# EasyEDA Pro project SSRC v1.eprj, board PCB3
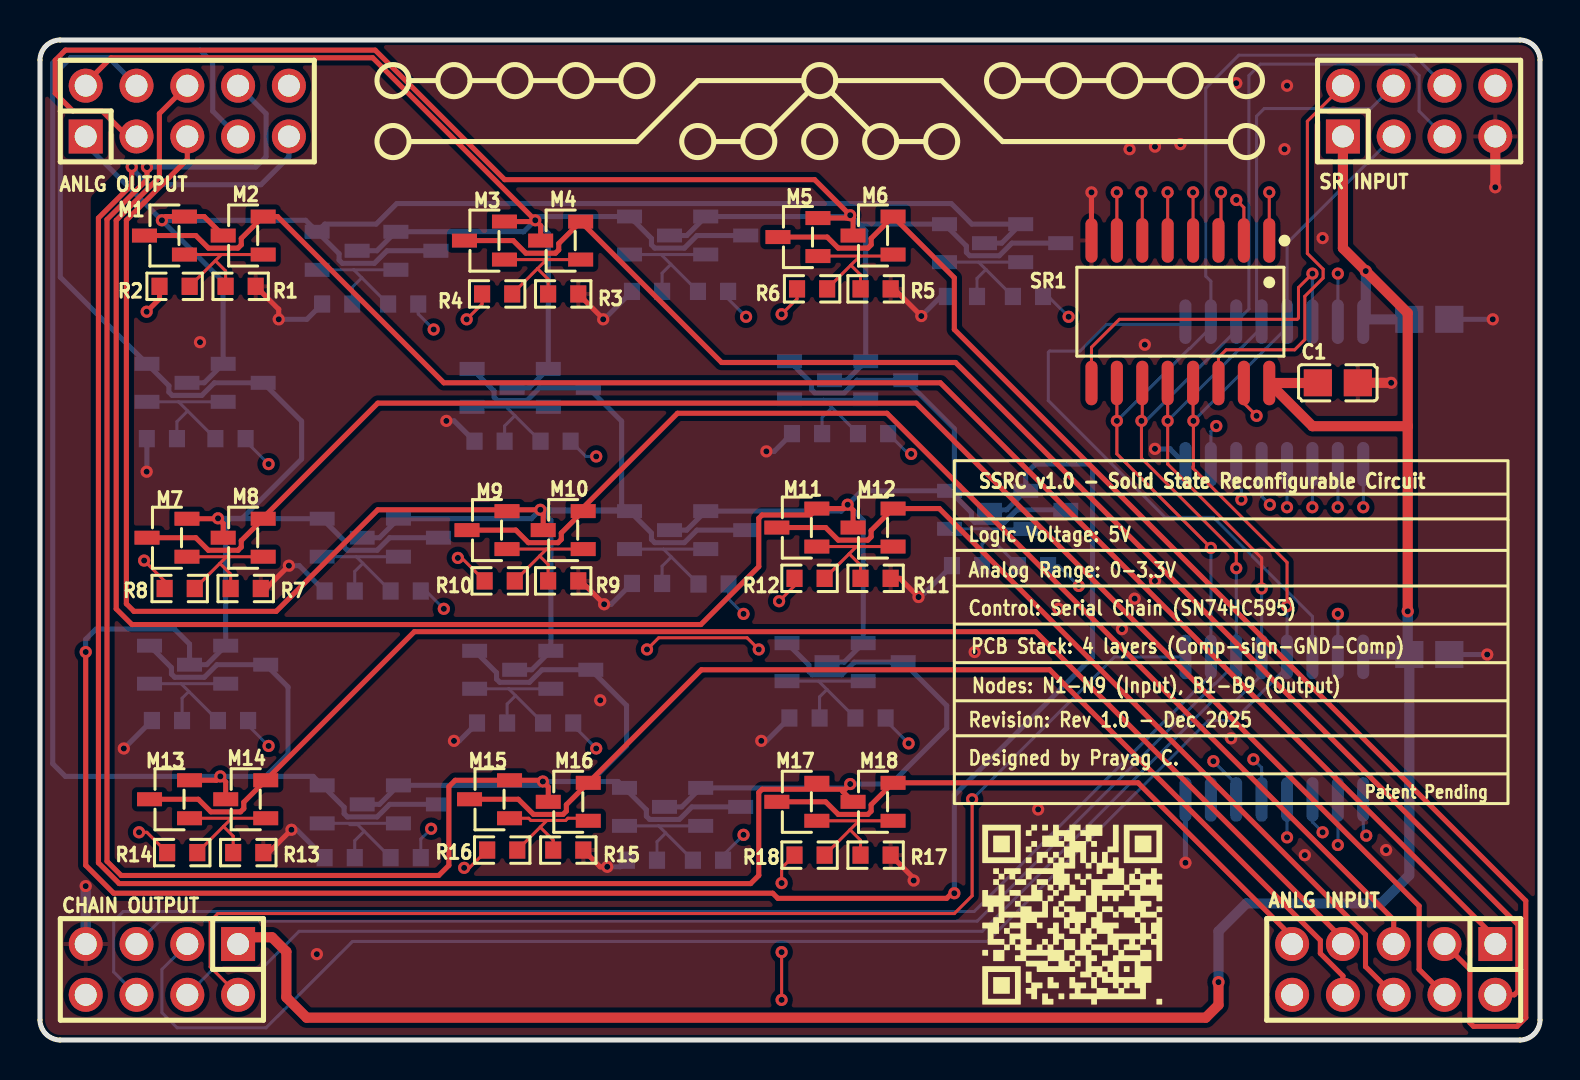
[diagram p2: board, top side]
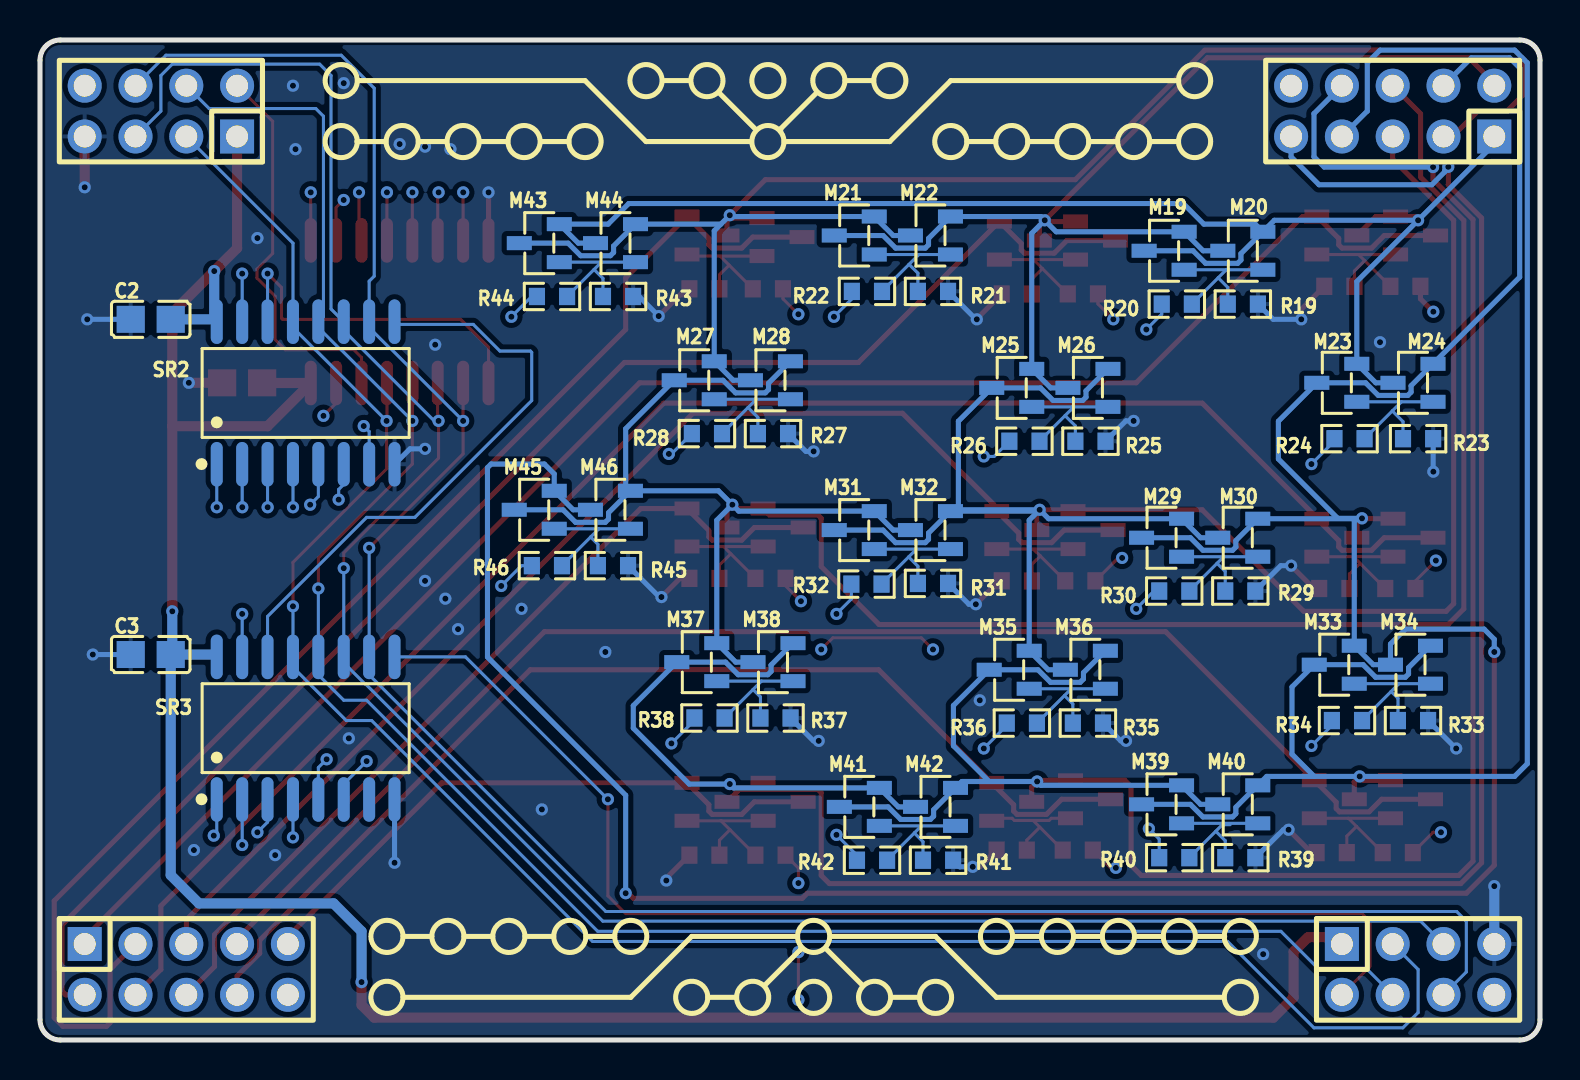
[diagram p3: board, bottom side, seen from below]

Outline 75.01 x 50.01 mm; copper layers: Top Layer, Inner1, Inner2, Inner3, Inner4, Inner5, Inner6, Inner7, Inner8, Inner9, Inner10, Inner11, Inner12, Inner13, Inner14, Inner15, Inner16, Inner17, Inner18, Inner19, Inner20, Inner21, Inner22, Inner23, Inner24, Inner25, Inner26, Inner27, Inner28, Inner29, Inner30, Bottom Layer. Coordinates in mm from the lower left corner of the outline.
Outline path: 0,49 0,1.02 arc(0.3,0.3) 1.02,0 73.99,0 arc(74.71,0.3) 75.01,1.02 75.01,49 arc(74.71,49.71) 73.99,50.01 1.02,50.01 arc(0.3,49.71) 0,49
Stack: Top Layer 0.035mm Outer layer thickness 1oz / Dielectric1 0.2104mm 7628 RC49% 8.6mil / Inner1 0.0152mm Inner layer thickness / Dielectric2 1.065mm 1.1mm H/HOZ Copper / Inner2 0.0152mm Inner layer thickness / Dielectric3 0.2104mm 7628 RC49% 8.6mil / Bottom Layer 0.035mm Outer layer thickness 1oz

## Design rules (mm)
template: JLCPCB Capability(Two Layers Board)
spacing copperThickness1oz (default): track to track 0.102, other pairs 0.152 to 0.3
spacing copperThickness2oz: track to track 0.203, other pairs 0.152 to 0.3
track width copperThickness1oz (default): min 0.127, default 0.254, max 2.54
track width copperThickness2oz: min 0.203, default 0.254, max 2.54
differential pair differentialPair (default): width min 0.127, default 0.254, max 2.54; gap min 0.152, default 0.152
via viaSize (default): diameter min 0.5, default 0.61, max 10; hole min 0.3, default 0.305, max 6.3

## Placement (name value [footprint] x y rotation side)
ANLG INPUT  PZ254V-12-10P  [HDR-TH_10P-P2.54-V-M-R2-C5-S2.54]  67.69 3.53 180 top
ANLG OUTPUT  PZ254V-12-10P  [HDR-TH_10P-P2.54-V-M-R2-C5-S2.54]  7.37 46.46 0 top
C1  100nF  [C0805]  64.9 32.87 0 top
C2  100nF  [C0805]  69.47 36.04 0 bottom
C3  100nF  [C0805]  69.47 19.28 0 bottom
CHAIN OUTPUT  PZ254V-12-8P  [HDR-TH_8P-P2.54-V-M-R2-C4-S2.54]  6.1 3.53 180 top
M1  -  [SOT-23-3_L2.9-W1.3-P1.90-LS2.4-BR]  6.22 40.23 0 top
M2  -  [SOT-23-3_L2.9-W1.3-P1.90-LS2.4-BR]  10.16 40.23 0 top
M3  -  [SOT-23-3_L2.9-W1.3-P1.90-LS2.4-BR]  22.23 39.98 0 top
M4  -  [SOT-23-3_L2.9-W1.3-P1.90-LS2.4-BR]  26.04 39.98 0 top
M5  -  [SOT-23-3_L2.9-W1.3-P1.90-LS2.4-BR]  37.9 40.16 0 top
M6  -  [SOT-23-3_L2.9-W1.3-P1.90-LS2.4-BR]  41.66 40.23 0 top
M7  -  [SOT-23-3_L2.9-W1.3-P1.90-LS2.4-BR]  6.35 25.12 0 top
M8  -  [SOT-23-3_L2.9-W1.3-P1.90-LS2.4-BR]  10.16 25.12 0 top
M9  -  [SOT-23-3_L2.9-W1.3-P1.90-LS2.4-BR]  22.35 25.5 0 top
M10  -  [SOT-23-3_L2.9-W1.3-P1.90-LS2.4-BR]  26.16 25.5 0 top
M11  -  [SOT-23-3_L2.9-W1.3-P1.90-LS2.4-BR]  37.85 25.63 0 top
M12  -  [SOT-23-3_L2.9-W1.3-P1.90-LS2.4-BR]  41.66 25.63 0 top
M13  -  [SOT-23-3_L2.9-W1.3-P1.90-LS2.4-BR]  6.48 12.04 0 top
M14  -  [SOT-23-3_L2.9-W1.3-P1.90-LS2.4-BR]  10.29 12.04 0 top
M15  -  [SOT-23-3_L2.9-W1.3-P1.90-LS2.4-BR]  22.48 12.04 0 top
M16  -  [SOT-23-3_L2.9-W1.3-P1.90-LS2.4-BR]  26.42 11.91 0 top
M17  -  [SOT-23-3_L2.9-W1.3-P1.90-LS2.4-BR]  37.85 11.91 0 top
M18  -  [SOT-23-3_L2.9-W1.3-P1.90-LS2.4-BR]  41.66 11.91 0 top
M19  -  [SOT-23-3_L2.9-W1.3-P1.90-LS2.4-BR]  18.8 39.47 180 bottom
M20  -  [SOT-23-3_L2.9-W1.3-P1.90-LS2.4-BR]  14.86 39.47 180 bottom
M21  -  [SOT-23-3_L2.9-W1.3-P1.90-LS2.4-BR]  34.29 40.23 180 bottom
M22  -  [SOT-23-3_L2.9-W1.3-P1.90-LS2.4-BR]  30.48 40.23 180 bottom
M23  -  [SOT-23-3_L2.9-W1.3-P1.90-LS2.4-BR]  10.16 32.87 180 bottom
M24  -  [SOT-23-3_L2.9-W1.3-P1.90-LS2.4-BR]  6.35 32.87 180 bottom
M25  -  [SOT-23-3_L2.9-W1.3-P1.90-LS2.4-BR]  26.42 32.61 180 bottom
M26  -  [SOT-23-3_L2.9-W1.3-P1.90-LS2.4-BR]  22.61 32.61 180 bottom
M27  -  [SOT-23-3_L2.9-W1.3-P1.90-LS2.4-BR]  42.29 32.99 180 bottom
M28  -  [SOT-23-3_L2.9-W1.3-P1.90-LS2.4-BR]  38.48 32.99 180 bottom
M29  -  [SOT-23-3_L2.9-W1.3-P1.90-LS2.4-BR]  18.92 25.12 180 bottom
M30  -  [SOT-23-3_L2.9-W1.3-P1.90-LS2.4-BR]  15.11 25.12 180 bottom
M31  -  [SOT-23-3_L2.9-W1.3-P1.90-LS2.4-BR]  34.29 25.5 180 bottom
M32  -  [SOT-23-3_L2.9-W1.3-P1.90-LS2.4-BR]  30.48 25.5 180 bottom
M33  -  [SOT-23-3_L2.9-W1.3-P1.90-LS2.4-BR]  10.29 18.77 180 bottom
M34  -  [SOT-23-3_L2.9-W1.3-P1.90-LS2.4-BR]  6.48 18.77 180 bottom
M35  -  [SOT-23-3_L2.9-W1.3-P1.90-LS2.4-BR]  26.54 18.52 180 bottom
M36  -  [SOT-23-3_L2.9-W1.3-P1.90-LS2.4-BR]  22.73 18.52 180 bottom
M37  -  [SOT-23-3_L2.9-W1.3-P1.90-LS2.4-BR]  42.16 18.9 180 bottom
M38  -  [SOT-23-3_L2.9-W1.3-P1.90-LS2.4-BR]  38.35 18.9 180 bottom
M39  -  [SOT-23-3_L2.9-W1.3-P1.90-LS2.4-BR]  18.92 11.79 180 bottom
M40  -  [SOT-23-3_L2.9-W1.3-P1.90-LS2.4-BR]  15.11 11.79 180 bottom
M41  -  [SOT-23-3_L2.9-W1.3-P1.90-LS2.4-BR]  34.04 11.66 180 bottom
M42  -  [SOT-23-3_L2.9-W1.3-P1.90-LS2.4-BR]  30.23 11.66 180 bottom
M43  -  [SOT-23-3_L2.9-W1.3-P1.90-LS2.4-BR]  50.04 39.85 180 bottom
M44  -  [SOT-23-3_L2.9-W1.3-P1.90-LS2.4-BR]  46.23 39.85 180 bottom
M45  -  [SOT-23-3_L2.9-W1.3-P1.90-LS2.4-BR]  50.29 26.52 180 bottom
M46  -  [SOT-23-3_L2.9-W1.3-P1.90-LS2.4-BR]  46.48 26.52 180 bottom
R1  -  [RC1206FR-07220KL]  10.03 37.69 0 top
R2  -  [RC1206FR-1022RL]  6.73 37.69 0 top
R3  -  [RC1206FR-07220KL]  26.16 37.31 0 top
R4  -  [RC1206FR-1022RL]  22.86 37.31 0 top
R5  -  [RC1206FR-07220KL]  41.78 37.57 0 top
R6  -  [RC1206FR-1022RL]  38.61 37.57 0 top
R7  -  [RC1206FR-07220KL]  10.29 22.58 0 top
R8  -  [RC1206FR-1022RL]  6.98 22.58 0 top
R9  -  [RC1206FR-07220KL]  26.16 22.96 0 top
R10  -  [RC1206FR-1022RL]  22.99 22.96 0 top
R11  -  [RC1206FR-07220KL]  41.78 23.09 0 top
R12  -  [RC1206FR-1022RL]  38.48 23.09 0 top
R13  -  [RC1206FR-07220KL]  10.41 9.37 0 top
R14  -  [RC1206FR-1022RL]  7.11 9.37 0 top
R15  -  [RC1206FR-07220KL]  26.42 9.5 0 top
R16  -  [RC1206FR-1022RL]  23.11 9.5 0 top
R17  -  [RC1206FR-07220KL]  41.78 9.25 0 top
R18  -  [RC1206FR-1022RL]  38.48 9.25 0 top
R19  -  [RC1206FR-07220KL]  14.86 36.8 180 bottom
R20  -  [RC1206FR-1022RL]  18.16 36.8 180 bottom
R21  -  [RC1206FR-07220KL]  30.35 37.44 180 bottom
R22  -  [RC1206FR-1022RL]  33.66 37.44 180 bottom
R23  -  [RC1206FR-07220KL]  6.1 30.07 180 bottom
R24  -  [RC1206FR-1022RL]  9.53 30.07 180 bottom
R25  -  [RC1206FR-07220KL]  22.48 29.95 180 bottom
R26  -  [RC1206FR-1022RL]  25.78 29.95 180 bottom
R27  -  [RC1206FR-07220KL]  38.35 30.33 180 bottom
R28  -  [RC1206FR-1022RL]  41.66 30.33 180 bottom
R29  -  [RC1206FR-07220KL]  14.99 22.45 180 bottom
R30  -  [RC1206FR-1022RL]  18.29 22.45 180 bottom
R31  -  [RC1206FR-07220KL]  30.35 22.83 180 bottom
R32  -  [RC1206FR-1022RL]  33.68 22.8 180 bottom
R33  -  [RC1206FR-07220KL]  6.35 15.98 180 bottom
R34  -  [RC1206FR-1022RL]  9.65 15.98 180 bottom
R35  -  [RC1206FR-07220KL]  22.61 15.85 180 bottom
R36  -  [RC1206FR-1022RL]  25.91 15.85 180 bottom
R37  -  [RC1206FR-07220KL]  38.23 16.1 180 bottom
R38  -  [RC1206FR-1022RL]  41.53 16.1 180 bottom
R39  -  [RC1206FR-07220KL]  14.99 9.12 180 bottom
R40  -  [RC1206FR-1022RL]  18.29 9.12 180 bottom
R41  -  [RC1206FR-07220KL]  30.1 8.99 180 bottom
R42  -  [RC1206FR-1022RL]  33.4 8.99 180 bottom
R43  -  [RC1206FR-07220KL]  46.1 37.19 180 bottom
R44  -  [RC1206FR-1022RL]  49.4 37.19 180 bottom
R45  -  [RC1206FR-07220KL]  46.36 23.72 180 bottom
R46  -  [RC1206FR-1022RL]  49.66 23.72 180 bottom
SR1  SN74HC595NSR  [SOP-16_L10.3-W5.4-P1.27-LS7.8-BL]  57.02 36.42 180 top
SR2  SN74HC595NSR  [SOP-16_L10.3-W5.4-P1.27-LS7.8-BL]  61.72 32.36 180 bottom
SR3  SN74HC595NSR  [SOP-16_L10.3-W5.4-P1.27-LS7.8-BL]  61.72 15.6 180 bottom
SR INPUT  PZ254V-12-8P  [HDR-TH_8P-P2.54-V-M-R2-C4-S2.54]  68.96 46.46 0 top

## Footprints (pads in the part's own frame, mm; a bottom-side part is the same pattern mirrored in y, then rotated)
C0805
  rect 1.41x1.35 smd: 1(-1,0) 2(1,0)
HDR-TH_8P-P2.54-V-M-R2-C4-S2.54
  rect 1.7x1.7 hole 1.1: 1(-3.81,-1.27)
  round 1.7 hole 1.1: 2(-3.81,1.27) 3(-1.27,-1.27) 4(-1.27,1.27) 5(1.27,-1.27) 6(1.27,1.27) 7(3.81,-1.27) 8(3.81,1.27)
HDR-TH_10P-P2.54-V-M-R2-C5-S2.54
  rect 1.7x1.7 hole 1.1: 1(-5.08,-1.27)
  round 1.7 hole 1.1: 2(-5.08,1.27) 3(-2.54,-1.27) 4(-2.54,1.27) 5(0,-1.27) 6(0,1.27) 7(2.54,-1.27) 8(2.54,1.27) 9(5.08,-1.27) 10(5.08,1.27)
RC1206FR-1022RL
  rect 0.806x0.864 smd: 1(-0.753,0) 2(0.753,0)
RC1206FR-07220KL
  rect 0.806x0.864 smd: 1(-0.753,0) 2(0.753,0)
SOP-16_L10.3-W5.4-P1.27-LS7.8-BL
  oval 0.602x2.231 smd: 1(-4.445,-3.566) 2(-3.175,-3.566) 3(-1.905,-3.566) 4(-0.635,-3.566) 5(0.635,-3.566) 6(1.905,-3.566) 7(3.175,-3.566) 8(4.445,-3.566) 9(4.445,3.566) 10(3.175,3.566) 11(1.905,3.566) 12(0.635,3.566) 13(-0.635,3.566) 14(-1.905,3.566) 15(-3.175,3.566) 16(-4.445,3.566)
SOT-23-3_L2.9-W1.3-P1.90-LS2.4-BR
  rect 1.25x0.7 smd: 1(1,-0.95) 2(1,0.95) 3(-1,0)

## Nets
+5V: C1.1 C2.1 C3.1 CHAIN OUTPUT.1 SR1.16 SR2.16 SR3.16 SR INPUT.1
GND: C1.2 C2.2 C3.2 CHAIN OUTPUT.7 R1.2 R3.2 R5.2 R7.2 R9.2 R11.2 R13.2 R15.2 R17.2 R19.2 R21.2 R23.2 R25.2 R27.2 R29.2 R31.2 R33.2 R35.2 R37.2 R39.2 R41.2 R43.2 R45.2 SR1.8 SR2.8 SR3.8 SR INPUT.7
B1: ANLG OUTPUT.1 M1.2 M2.3 M19.3 M20.2 M23.2 M24.3 M43.2 M44.3
B2: ANLG OUTPUT.2 M3.2 M4.3 M19.2 M20.3 M21.3 M22.2 M25.2 M26.3
B3: ANLG OUTPUT.3 M5.2 M6.3 M21.2 M22.3 M27.2 M28.3 M43.3 M44.2
B4: ANLG OUTPUT.4 M7.2 M8.3 M23.3 M24.2 M29.3 M30.2 M33.2 M34.3 M45.2 M46.3
B5: ANLG OUTPUT.5 M9.2 M10.3 M25.3 M26.2 M29.2 M30.3 M31.3 M32.2 M35.2 M36.3
B6: ANLG OUTPUT.6 M11.2 M12.3 M27.3 M28.2 M31.2 M32.3 M37.2 M38.3 M45.3 M46.2
B7: ANLG OUTPUT.7 M13.2 M14.3 M33.3 M34.2 M39.3 M40.2
B8: ANLG OUTPUT.8 M15.2 M16.3 M35.3 M36.2 M39.2 M40.3 M41.3 M42.2
B9: ANLG OUTPUT.9 M17.2 M18.3 M37.3 M38.2 M41.2 M42.3
G1: R2.1 SR1.15
G3: R4.1 SR1.1
G5: R6.1 SR1.2
G7: R8.1 SR1.3
G9: R10.1 SR1.4
G11: R12.1 SR1.5
G13: R14.1 SR1.6
G15: R16.1 SR1.7
G17: R18.1 SR2.15
G19: R20.1 SR2.1
G21: R22.1 SR2.2
G23: R24.1 SR2.3
G25: R26.1 SR2.4
G27: R28.1 SR2.5
G29: R30.1 SR2.6
G31: R32.1 SR2.7
G33: R34.1 SR3.15
G35: R36.1 SR3.1
G37: R38.1 SR3.2
G39: R40.1 SR3.3
G41: R42.1 SR3.4
G43: R44.1 SR3.5
G45: R46.1 SR3.6
LCLK: CHAIN OUTPUT.4 SR1.12 SR2.12 SR3.12 SR INPUT.4
MR: CHAIN OUTPUT.6 SR1.10 SR2.10 SR3.10 SR INPUT.6
N1: ANLG INPUT.1 M1.3 M2.2
N2: ANLG INPUT.2 M3.3 M4.2
N3: ANLG INPUT.3 M5.3 M6.2
N4: ANLG INPUT.4 M7.3 M8.2
N5: ANLG INPUT.5 M9.3 M10.2
N6: ANLG INPUT.6 M11.3 M12.2
N7: ANLG INPUT.7 M13.3 M14.2
N8: ANLG INPUT.8 M15.3 M16.2
N9: ANLG INPUT.9 M17.3 M18.2
OE: CHAIN OUTPUT.3 SR1.13 SR2.13 SR3.13 SR INPUT.3
SCLK: CHAIN OUTPUT.5 SR1.11 SR2.11 SR3.11 SR INPUT.5
$1N322: M25.1 M26.1 R25.1 R26.2
$1N1509: M41.1 M42.1 R41.1 R42.2
$1N1583: M39.1 M40.1 R39.1 R40.2
$1N1657: M33.1 M34.1 R33.1 R34.2
$1N1731: M23.1 M24.1 R23.1 R24.2
$1N4820: M1.1 M2.1 R1.1 R2.2
$1N4826: M3.1 M4.1 R3.1 R4.2
$1N4832: M5.1 M6.1 R5.1 R6.2
$1N4838: M7.1 M8.1 R7.1 R8.2
$1N4844: M9.1 M10.1 R9.1 R10.2
$1N4850: M11.1 M12.1 R11.1 R12.2
$1N4856: M13.1 M14.1 R13.1 R14.2
$1N4862: M15.1 M16.1 R15.1 R16.2
$1N4868: M17.1 M18.1 R17.1 R18.2
$1N10938: M27.1 M28.1 R27.1 R28.2
$1N10996: M19.1 M20.1 R19.1 R20.2
$1N11052: M21.1 M22.1 R21.1 R22.2
$1N11108: M29.1 M30.1 R29.1 R30.2
$1N11164: M31.1 M32.1 R31.1 R32.2
$1N11220: M35.1 M36.1 R35.1 R36.2
$1N11276: M37.1 M38.1 R37.1 R38.2
$1N19303: M43.1 M44.1 R43.1 R44.2
$1N19419: M45.1 M46.1 R45.1 R46.2
$1N32987: SR1.9 SR2.14
$1N32993: SR2.9 SR3.14
$1N34192: SR1.14 SR INPUT.2
$1N34221: CHAIN OUTPUT.2 SR3.9

Pads without a net: ANLG INPUT 10; ANLG OUTPUT 10; CHAIN OUTPUT 8; SR3 7; SR INPUT 8

## Via types
v1: diameter 0.61, hole 0.305, Top Layer to Bottom Layer, 119 vias

## Routing (per net, layer and track width the routed paths; a pad name or vN(x,y) marks a point on that pad's centre or on a via; arc(x,y) is an arc through that point)
+5V: length 122.5
  Top Layer w0.508: 68.39,30.7 68.39,36.36 v1(66.29,38.46) 65.15,39.6 SR INPUT.1 ; 68.39,30.7 63.63,30.7 SR1.16 63.89,32.86 C1.1 ; 68.39,30.7 v1(68.39,21.44) ; CHAIN OUTPUT.1 10.24,5.14 11.6,5.14 12.32,4.42 12.32,2.13 13.34,1.12 58.29,1.12 58.93,1.75 v1(58.93,2.9)
  Bottom Layer w0.508: v1(66.29,38.46) 66.29,36.05 66.28,36.04 ; v1(68.39,21.44) 68.39,19.36 C3.1 ; C3.1 66.28,19.28 SR3.16 ; C3.1 68.47,8.25 67.06,6.83 60.33,6.83 58.93,5.44 v1(58.93,2.9) ; 66.28,36.04 SR2.16 ; 66.28,36.04 C2.1
GND: length 61.7
  Top Layer w0.254: v1(12.45,23.72) 11.3,22.58 R7.2 ; R11.2 43,23.09 v1(43.93,22.15) ; v1(43.69,7.98) 43.69,8.09 R17.2 ; v1(28.16,36.04) 28.16,36.07 R3.2 ; SR1.8 v1(52.58,42.39) ; R5.2 42.71,37.57 v1(44.07,36.21) ; v1(28.21,21.79) 27.04,22.96 R9.2 ; v1(28.36,8.66) 28.01,8.66 R15.2 ; R13.2 11.43,9.37 v1(12.57,10.52) ; v1(11.94,36.04) 11.94,36.54 R1.2
  Top Layer w0.508: v1(67.56,32.87) C1.2 ; SR INPUT.7 v1(72.77,42.65)
  Bottom Layer w0.254: R33.2 4.2,14.58 v1(4.19,14.58) ; R41.2 29.02,8.66 v1(28.36,8.66) ; R43.2 45.05,37.19 v1(44.07,36.21) ; R31.2 28.56,21.79 v1(28.21,21.79) ; R39.2 12.84,10.52 v1(12.57,10.52) ; R35.2 20.96,14.96 v1(20.7,14.96) ; R27.2 36.71,29.44 v1(36.32,29.44) ; v1(28.16,36.04) 28.2,36.04 R21.2 ; v1(12.45,23.72) 12.96,23.72 R29.2 ; v1(5.33,28.42) 5.34,28.43 R23.2 ; v1(20.32,30.96) 20.71,30.96 R25.2 ; C2.2 v1(72.64,36.04) ; R45.2 44.03,22.15 v1(43.93,22.15) ; v1(11.94,36.04) 13.34,36.04 R19.2 ; v1(55.75,29.57) 56.51,29.57 SR2.8 ; v1(36.07,14.96) 36.33,14.96 R37.2 ; C3.2 v1(72.37,19.28) ; SR3.8 v1(57.28,8.86)
  Bottom Layer w0.508: CHAIN OUTPUT.7 v1(2.29,7.7)
  vias: v1(8,34.9) v1(13.84,4.29) v1(28.01,16.99) v1(46.74,19.41) v1(49.91,11.53) v1(50.93,21.56) v1(54.1,20.55) v1(54.48,44.55) v1(54.74,22.07) v1(55.25,34.77) v1(55.75,44.68) v1(55.75,22.96) v1(57.02,44.81) v1(59.56,15.09) v1(59.82,47.85) v1(62.23,44.55) v1(62.36,47.73) v1(63.25,9.25) v1(64.14,40.11) v1(67.31,9.5)
B1: length 73.4
  Top Layer w0.254: M2.3 8.21,41.18 6.28,41.18 v1(6.1,41)
  Bottom Layer w0.254: M19.3 17.35,39.47 16.72,38.84 15.12,38.84 14.95,39.01 14.95,39.33 M20.2 ; M24.3 8.21,32.87 M23.2 9.16,37.93 v1(6.1,41) ; M20.2 14.24,40.8 16.81,40.8 17.84,41.83 45.57,41.83 46.6,40.8 M43.2 48.09,39.85 M44.3 ; M20.2 13.29,41 v1(6.1,41) ; v1(6.1,41) 2.29,44.81 ANLG OUTPUT.1
B2: length 60.3
  Top Layer w0.254: M4.3 25.04,40.73 v1(24.77,41) ; v1(24.77,41) 24.7,40.93 M3.2 ; v1(24.77,41) 16.64,49.12 3.56,49.12 2.29,47.85 ANLG OUTPUT.2
  Bottom Layer w0.254: v1(24.77,41) 24.19,40.42 M19.2 16.85,39.47 M20.3 ; v1(24.77,41) 24.95,41.18 29.48,41.18 30.58,40.09 30.58,39.77 30.74,39.6 32.22,39.6 32.85,40.23 M21.3 ; v1(24.77,41) 25.42,40.34 M25.2 24.47,32.61 M26.3
B3: length 83.2
  Top Layer w0.254: v1(40.51,41.25) 40.66,41.11 M6.3 ; v1(40.51,41.25) 40.37,41.11 M5.2 ; v1(40.51,41.25) 38.73,43.03 23.24,43.03 16.76,49.5 1.27,49.5 0.76,49 0.76,47.35 1.65,46.46 3.11,46.46 4.38,45.19 ANLG OUTPUT.3
  Bottom Layer w0.254: M28.3 40.34,32.99 M27.2 41.29,40.47 40.96,40.8 ; 40.96,40.8 M44.2 46.32,39.71 46.32,39.39 46.49,39.22 47.97,39.22 48.6,39.85 M43.3 ; 40.96,40.8 v1(40.51,41.25) 40.45,41.18 33.29,41.18 32.34,40.23 M22.3
B4: length 154.6
  Top Layer w0.254: M7.2 8.88,26.07 v1(8.9,26.09) 9.16,25.83 M8.3 ; v1(45.72,7.34) 45.59,7.34 45.34,7.09 36.89,7.09 36.64,7.34 3.68,7.34 2.29,8.74 v1(2.29,19.41)
  Bottom Layer w0.254: 9.18,26.07 9.29,25.96 M33.2 8.34,18.77 M34.3 7.48,19.8 6.73,20.55 2.79,20.55 2.29,20.04 v1(2.29,19.41) ; 9.18,26.07 M30.2 15.21,24.97 15.21,24.65 15.37,24.49 16.85,24.49 17.48,25.12 M29.3 ; 9.18,26.07 8.92,26.07 v1(8.9,26.09) 10.11,26.09 13.08,29.06 13.08,30.95 M23.3 8.72,32.87 8.09,32.24 6.61,32.24 6.45,32.4 6.45,32.72 M24.2 1.02,38.15 1.02,48.62 1.52,49.12 3.43,49.12 ANLG OUTPUT.4 ; M46.3 48.34,26.52 M45.2 49.29,28.31 49.78,28.8 52.45,28.8 52.63,28.62 52.63,19.15 45.72,12.24 v1(45.72,7.34)
B5: length 96.6
  Top Layer w0.254: M10.3 25.16,26.37 v1(25.02,26.52) 16.89,26.52 11.81,21.44 4.7,21.44 4.32,21.82 4.32,41 7.37,44.04 ANLG OUTPUT.5
  Bottom Layer w0.254: M36.3 24.59,18.52 M35.2 25.54,25.99 25.08,26.45 29.48,26.45 30.58,25.36 30.58,25.04 30.74,24.87 32.22,24.87 32.85,25.5 M31.3 ; M26.2 22.7,32.47 22.7,32.15 22.87,31.98 24.35,31.98 24.98,32.61 M25.3 29.08,30.95 29.08,26.52 v1(25.02,26.52) 24.57,26.07 M29.2 16.97,25.12 M30.3
B6: length 114.6
  Top Layer w0.254: M12.3 40.66,26.5 v1(40.39,26.77) 40.19,26.58 M11.2 38.52,26.26 36.11,26.26 35.94,26.09 35.94,23.67 33.05,20.78 4.6,20.78 3.81,21.56 3.81,40.99 5.97,43.15 5.97,46.33 ANLG OUTPUT.6
  Bottom Layer w0.254: M28.2 38.58,32.85 38.58,32.53 38.74,32.37 40.22,32.37 40.85,32.99 M27.3 45.72,30.57 45.72,27.47 M46.2 ; M32.3 32.34,25.5 33.29,26.45 40.07,26.45 v1(40.39,26.77) ; M38.3 40.21,18.9 41.16,19.85 41.16,25.99 v1(40.39,26.77) ; v1(40.39,26.77) 41.08,27.47 M46.2 ; M46.2 46.58,26.37 46.58,26.05 46.74,25.89 48.22,25.89 48.85,26.52 M45.3
B7: length 84.9
  Top Layer w0.254: M14.3 9.29,12.91 v1(9.02,13.18) 8.82,12.99 M13.2
  Bottom Layer w0.254: M34.2 6.57,18.62 6.57,18.3 6.74,18.14 8.22,18.14 8.85,18.77 M33.3 12.4,17.66 12.4,14.3 11.29,13.18 ; 11.29,13.18 13.67,13.18 M40.2 15.21,11.64 15.21,11.32 15.37,11.16 16.85,11.16 17.48,11.79 M39.3 ; 11.29,13.18 v1(9.02,13.18) 1.27,13.18 0.64,13.82 0.64,48.87 1.27,49.5 8,49.5 8.64,48.87 8.64,46.46 ANLG OUTPUT.7
B8: length 108
  Top Layer w0.254: M16.3 25.42,12.66 v1(25.15,12.93) 25.08,12.99 M15.2 20.76,12.99 20.45,12.67 20.45,8.74 19.94,8.23 4.06,8.23 3.35,8.94 3.35,41.03 5.35,43.03 v1(5.35,43.66)
  Bottom Layer w0.254: 27.54,12.93 28.91,12.93 M42.2 30.32,11.51 30.32,11.19 30.49,11.03 31.97,11.03 32.6,11.66 M41.3 ; 27.54,12.93 v1(25.15,12.93) 24.95,12.74 M39.2 16.97,11.79 M40.3 ; 27.54,12.93 29.33,14.72 29.33,16.73 M35.3 25.1,18.52 24.47,17.89 22.99,17.89 22.83,18.05 22.83,18.37 M36.2 ; ANLG OUTPUT.8 11.3,46.33 11.3,44.17 10.79,43.66 v1(5.35,43.66)
B9: length 115.6
  Top Layer w0.254: v1(4.59,43.67) 4.59,42.77 2.92,41.11 2.92,8.86 3.96,7.82 35.54,7.82 35.94,8.23 35.94,12.38 36.11,12.54 40.25,12.54 ; 40.25,12.54 40.14,12.43 M18.3 ; 40.25,12.54 v1(40.51,12.8)
  Bottom Layer w0.254: 37.35,19.85 38.45,18.75 38.45,18.43 38.61,18.27 40.09,18.27 40.72,18.9 M37.3 45.34,16.72 45.34,15.6 42.55,12.8 v1(40.51,12.8) 40.32,12.61 M41.2 32.09,11.66 M42.3 ; v1(4.59,43.67) 4.76,43.49 4.76,43.42 5.41,42.77 11.05,42.77 12.45,44.17 ANLG OUTPUT.9
G1: length 61.1
  Top Layer w0.152: SR1.15 60.2,31.85 v1(60.83,31.22)
  Top Layer w0.254: v1(5.33,36.42) 5.98,37.07 R2.1
  Inner1 w0.152: v1(5.33,36.42) 9.65,32.11 59.8,32.11 60.69,31.22 v1(60.83,31.22)
G3: length 50.9
  Top Layer w0.152: R4.1 22.11,36.81 v1(21.34,36.04) ; v1(61.47,42.39) SR1.1
  Inner1 w0.152: v1(61.47,42.39) 61.47,37.44 61.28,37.25 39.3,37.25 37.59,35.53 37.05,35.53 35.53,37.06 22.35,37.06 v1(21.34,36.04)
G5: length 32
  Top Layer w0.152: SR1.2 60.2,41.63 v1(59.82,42.01) ; v1(37.08,36.3) 37.85,37.07 R6.1
  Inner1 w0.152: v1(37.08,36.3) 37.99,36.3 39.2,37.5 60.13,37.5 60.2,37.57 60.2,41.63 v1(59.82,42.01)
G7: length 91.7
  Top Layer w0.152: v1(5.21,23.98) 6.23,22.95 R8.1 ; SR1.3 59.05,40.12 v1(59.05,42.39)
  Inner1 w0.152: v1(5.21,23.98) 5.08,23.85 2.16,23.85 1.65,24.36 1.65,42.52 2.03,42.9 13.97,42.9 14.61,43.54 14.61,46.58 15.11,47.09 58.42,47.09 59.05,46.46 v1(59.05,42.39)
G9: length 104.1
  Top Layer w0.152: v1(57.66,42.39) SR1.4 ; R10.1 21.08,24.11 v1(20.9,24.11)
  Inner1 w0.152: v1(20.9,24.11) 20.5,24.51 2.13,24.51 1.91,24.74 1.91,42.27 2.16,42.52 14.22,42.52 14.99,43.28 14.99,46.08 15.49,46.58 57.28,46.58 57.66,46.2 v1(57.66,42.39)
G11: length 117.1
  Top Layer w0.152: v1(36.96,21.95) 37.73,22.72 R12.1 ; SR1.5 56.39,42.39 v1(56.38,42.39)
  Inner1 w0.152: v1(36.96,21.95) 34.04,24.87 2.54,24.87 2.29,25.12 2.29,41.76 2.54,42.01 14.35,42.01 15.49,43.15 15.49,45.57 15.88,45.95 56.13,45.95 56.38,45.7 v1(56.38,42.39)
G13: length 166.4
  Top Layer w0.152: v1(55.08,42.39) 55.12,42.35 SR1.6 ; v1(4.95,10.39) 5.34,10.39 R14.1
  Inner1 w0.152: v1(55.08,42.39) 55.08,45.1 54.74,45.44 16.26,45.44 15.88,45.06 15.88,42.9 14.61,41.63 2.79,41.63 2.54,41.38 2.54,25.37 2.79,25.12 34.16,25.12 36.7,22.58 37.43,22.58 37.49,22.52 37.49,21.49 37.34,21.34 36.81,21.34 33.79,24.36 22.1,24.36 21.32,23.58 20.47,23.58 19.94,24.1 13.72,24.1 12.57,22.96 11.81,22.96 10.8,23.98 5.97,23.98 5.33,23.34 3.49,23.34 3.43,23.28 3.43,14.45 4.83,13.06 4.83,10.52 v1(4.95,10.39)
G15: length 182.8
  Top Layer w0.152: v1(21.21,8.61) 21.47,8.61 R16.1 ; SR1.7 53.85,42.39 v1(53.84,42.39) ; v1(30.35,19.53) 30.94,20.12 35.36,20.12 v1(35.94,19.53)
  Inner1 w0.152: v1(35.94,19.53) 35.94,20.04 36.98,21.08 37.59,21.08 37.85,21.34 37.85,22.58 37.59,22.83 36.83,22.83 34.29,25.37 3.05,25.37 2.98,25.44 2.98,40.93 3.18,41.12 5.22,41.12 5.88,40.46 6.32,40.46 6.98,41.12 14.86,41.12 16.38,42.65 16.38,44.55 16.64,44.81 53.59,44.81 53.84,44.55 v1(53.84,42.39) ; v1(30.35,19.53) 29.34,20.55 20.45,20.55 19.62,21.38 19.62,23.53 19.3,23.85 13.82,23.85 12.68,22.71 11.68,22.71 10.67,23.72 6.08,23.72 5.44,23.09 3.85,23.09 3.68,22.93 3.68,15.98 5.08,14.58 5.08,11.02 7.62,8.48 21.08,8.48 v1(21.21,8.61)
G17: length 76.7
  Top Layer w0.152: v1(37.08,7.85) 37.08,8.6 R18.1 ; v1(37.08,4.39) v1(37.08,2.01)
  Inner1 w0.152: v1(64.9,38.33) 64.9,37.67 68.92,33.64 68.92,7.11 68.77,6.96 59.05,6.96 54.1,2.01 v1(37.08,2.01) ; v1(37.08,4.39) v1(37.08,7.85)
  Bottom Layer w0.152: SR2.15 v1(64.9,38.33)
G19: length 62
  Inner1 w0.152: v1(19.69,35.53) 19.84,35.38 21.69,35.38 23.11,36.8 35.43,36.8 36.95,35.28 37.7,35.28 39.41,36.99 60.77,36.99 61.21,36.55 65.66,36.55 66.17,36.04 v1(66.17,26.64)
  Bottom Layer w0.152: SR2.1 v1(66.17,26.64) ; R20.1 18.91,36.3 v1(19.69,35.53)
G21: length 44.3
  Inner1 w0.152: v1(35.31,36.17) 35.7,36.17 36.84,35.03 37.8,35.03 39.52,36.74 60.64,36.74 61.09,36.3 64.64,36.3 64.89,36.05 v1(64.89,26.64)
  Bottom Layer w0.152: v1(64.89,26.64) 64.9,26.65 SR2.2 ; v1(35.31,36.17) 34.41,37.07 R22.1
G23: length 61.6
  Inner1 w0.152: v1(11.43,28.8) 14.48,31.85 59.44,31.85 60.97,30.33 63.5,30.33 63.62,30.2 v1(63.62,26.64)
  Bottom Layer w0.152: v1(63.62,26.64) 63.63,26.65 SR2.3 ; R24.1 10.28,29.95 v1(11.43,28.8)
G25: length 43.1
  Inner1 w0.152: v1(62.35,26.64) 62.35,29.69 62.1,29.95 60.99,29.95 59.34,31.6 30.23,31.6 v1(27.81,29.18)
  Bottom Layer w0.152: v1(27.81,29.18) 27.3,29.18 R26.1 ; v1(62.35,26.64) 62.36,26.65 62.36,28.79
G27: length 27.1
  Inner1 w0.152: v1(43.56,29.31) 45.59,31.34 53.09,31.34 53.32,31.11 53.32,30.74 53.73,30.33 57.79,30.33 58.21,30.74 58.21,31.13 58.42,31.34 59.23,31.34 61.5,29.08 v1(61.5,26.77)
  Bottom Layer w0.152: R28.1 43.43,29.31 v1(43.56,29.31) ; SR2.5 61.09,27.18 v1(61.5,26.77)
G29: length 52.2
  Inner1 w0.152: v1(60.07,27.03) 44.2,27.03 36.17,19 35.72,19 35.41,19.31 35.41,19.89 36.32,20.8 36.32,21.31 33.53,24.1 22.73,24.1 v1(20.19,21.56)
  Bottom Layer w0.152: v1(60.07,27.03) 60.07,27.03 60.07,27.53 59.82,27.79 SR2.6 ; R30.1 19.3,22.45 v1(20.19,21.56)
G31: length 39.8
  Inner1 w0.152: v1(58.82,30.7) 60.61,28.92 60.61,26.8 60.58,26.78 60.58,26.77 60.51,26.71 60.51,26.71 60.29,26.49 59.72,26.49 59.44,26.77 44.3,26.77 36.27,18.74 35.61,18.74 35.15,19.21 35.15,21.28 v1(35.18,21.31)
  Bottom Layer w0.152: v1(58.82,30.7) 58.55,30.43 SR2.7 ; R32.1 34.43,22.06 v1(35.18,21.31)
G33: length 87.5
  Inner1 w0.152: v1(11.43,14.71) 16.76,9.37 21.46,9.37 22.35,8.48 22.35,2.9 22.99,2.26 36.58,2.26 36.86,2.54 37.3,2.54 37.58,2.26 53.98,2.26 58.93,7.21 67.69,7.21 67.84,7.37 67.84,20.52 67.06,21.31 v1(64.9,21.31)
  Bottom Layer w0.152: v1(11.43,14.71) 10.41,15.73 R34.1 ; SR3.15 v1(64.9,21.31)
G35: length 67.8
  Inner1 w0.152: v1(66.32,10.22) 66.32,7.49 66.29,7.47 58.8,7.47 53.85,2.51 37.85,2.51 37.57,2.79 36.76,2.79 36.73,2.77 36.7,2.77 36.45,2.51 23.75,2.51 23.37,2.9 23.37,14.33 23.75,14.71 27.69,14.71 v1(27.81,14.58)
  Bottom Layer w0.152: v1(66.32,10.22) 66.17,10.37 SR3.1 ; R36.1 26.66,15.73 v1(27.81,14.58)
G37: length 40.4
  Inner1 w0.152: v1(64.9,9.75) 64.9,7.85 64.77,7.72 58.68,7.72 53.73,2.77 45.34,2.77 44.96,3.15 44.96,13.31 v1(43.43,14.83)
  Bottom Layer w0.152: R38.1 42.28,15.98 v1(43.43,14.83) ; SR3.2 v1(64.9,9.75)
G39: length 76.5
  Inner1 w0.152: v1(64.14,10.39) 64.14,8.23 64.07,8.16 58.61,8.16 53.59,3.15 45.47,3.15 45.21,3.4 45.21,6.08 46.25,7.12 46.25,7.57 45.21,8.61 45.21,13.81 43.17,15.85 42.42,15.85 35.31,8.74 30.48,8.74 30.42,8.8 30.42,12.73 28.03,15.11 23.8,15.11 23.11,14.43 23.11,10.69 22.99,10.57 v1(19.56,10.57)
  Bottom Layer w0.152: v1(19.56,10.57) 19.04,10.05 R40.1 ; SR3.3 63.63,10.9 v1(64.14,10.39)
G41: length 35.9
  Inner1 w0.152: v1(35.18,10.26) 36.32,10.26 42.42,16.36 43.56,16.36 46.51,13.41 59.08,13.41 v1(62.36,10.13)
  Bottom Layer w0.152: 62.36,12.03 v1(62.36,10.13) ; R42.1 34.15,9.24 v1(35.18,10.26)
G43: length 38.6
  Inner1 w0.152: v1(51.44,36.17) 51.75,36.48 60.53,36.48 64.26,32.75 64.26,17.63 v1(60.67,14.04)
  Bottom Layer w0.152: SR3.5 61.09,13.63 v1(60.67,14.04) ; R44.1 50.42,37.19 v1(51.44,36.17)
G45: length 15.9
  Inner1 w0.152: v1(58.67,13.94) 51.94,20.68 v1(51.94,22.71)
  Bottom Layer w0.152: v1(58.67,13.94) 59.82,12.8 SR3.6 ; R46.1 50.93,23.72 v1(51.94,22.71)
LCLK: length 101.7
  Top Layer w0.152: v1(61.09,22.58) 61.09,24.1 56.39,28.8 56.39,30.96 v1(56.39,30.96) 56.39,30.96 SR1.12
  Bottom Layer w0.152: SR INPUT.4 66.55,46.58 61.21,46.58 60.83,46.2 60.83,36.18 SR2.12 61.09,35.63 60.04,34.58 60,34.58 v1(56.39,30.96) ; CHAIN OUTPUT.4 8.64,3.53 11.05,3.53 12.95,5.44 47.12,5.44 58.67,16.99 59.82,16.99 61.09,18.26 SR3.12 v1(61.09,22.58)
MR: length 112.6
  Top Layer w0.152: v1(58.55,24.61) 53.85,29.31 v1(53.85,30.96) SR1.10
  Bottom Layer w0.152: v1(53.85,30.96) 57.47,34.58 57.5,34.58 58.55,35.63 SR2.10 58.55,37.95 58.29,38.2 58.29,47.6 59.94,49.25 68.71,49.25 SR INPUT.6 ; CHAIN OUTPUT.6 3.68,3.4 3.68,5.94 4.17,6.43 46.71,6.43 58.55,18.26 SR3.10 v1(58.55,24.61)
N1: length 83.9
  Top Layer w0.254: 72.77,4.8 72.77,5.12 45.02,32.87 20.19,32.87 11.88,41.18 11.16,41.18 10.06,40.09 10.06,39.77 9.9,39.6 8.42,39.6 7.79,40.23 M1.3
N2: length 72.9
  Top Layer w0.254: 72.77,2.26 73.72,2.26 73.9,2.44 73.9,5.77 45.78,33.88 34.08,33.88 M4.2 25.94,39.83 25.94,39.51 25.78,39.35 24.29,39.35 23.67,39.98 M3.3
N3: length 67.5
  Top Layer w0.254: ANLG INPUT.3 71.5,3.53 71.5,0.86 71.68,0.68 73.86,0.68 74.3,1.12 74.3,6.96 45.72,35.53 45.72,38.12 42.66,41.18 41.56,40.09 41.56,39.77 41.4,39.6 39.92,39.6 39.36,40.16 M5.3
N4: length 82.5
  Top Layer w0.254: M7.3 7.79,25.12 8.42,24.49 9.9,24.49 10.06,24.65 10.06,24.97 M8.2 11.16,26.12 16.89,31.85 43.82,31.85 68.96,6.71 68.96,3.53 ANLG INPUT.4
N5: length 61.3
  Top Layer w0.254: M9.3 23.79,25.5 24.42,24.87 25.9,24.87 26.07,25.04 26.07,25.36 27.16,26.45 27.16,26.63 31.88,31.34 42.35,31.34 67.69,6.01 ANLG INPUT.5
N6: length 43
  Top Layer w0.254: ANLG INPUT.6 66.28,3.67 66.28,5.27 44.97,26.58 M12.2 41.56,25.48 41.56,25.16 41.4,25 39.92,25 39.29,25.63 M11.3
N7: length 70.5
  Top Layer w0.254: 65.15,4.8 65.15,5.05 49.78,20.42 18.72,20.42 M14.2 10.19,11.89 10.19,11.57 10.03,11.41 8.55,11.41 7.92,12.04 M13.3
N8: length 54.8
  Top Layer w0.254: M15.3 23.92,12.04 24.68,11.28 26.16,11.28 26.32,11.45 26.32,11.77 M16.2 33.07,18.52 50.49,18.52 64.02,4.99 64.02,4.33 65.15,3.2 65.15,2.26
N9: length 30.4
  Top Layer w0.254: ANLG INPUT.9 62.61,5.16 54.91,12.86 M18.2 41.56,11.77 41.56,11.45 41.4,11.28 39.92,11.28 39.29,11.91 M17.3
OE: length 102.6
  Top Layer w0.152: v1(62.36,21.69) 62.36,23.89 57.66,28.58 57.66,28.68 57.67,28.69 v1(57.67,30.96) 57.66,30.98 SR1.13
  Bottom Layer w0.152: v1(62.36,21.69) 62.36,18.64 59.69,15.98 58.42,15.98 47.37,4.93 15.62,4.93 11.3,0.61 6.86,0.61 6.1,1.37 6.1,3.53 CHAIN OUTPUT.3 ; v1(57.67,30.96) 61.29,34.58 61.31,34.58 62.36,35.63 62.36,39.85 SR INPUT.3
SCLK: length 109
  Top Layer w0.152: SR1.11 55.12,31 v1(55.08,30.96) 55.08,29.1 59.82,24.36 v1(59.82,23.6)
  Bottom Layer w0.152: SR INPUT.5 68.96,46.46 68.96,48.23 68.39,48.8 61.02,48.8 60.45,48.23 60.45,36.56 SR2.11 59.82,35.49 55.29,30.96 v1(55.08,30.96) ; v1(59.82,23.6) SR3.11 59.82,18.87 58.77,17.82 58.74,17.82 46.86,5.94 5.97,5.94 CHAIN OUTPUT.5
$1N322: length 7.7
  Bottom Layer w0.152: M25.1 23.31,31.66 ; 23.31,31.66 23.75,31.23 ; 23.31,31.66 M26.1 ; 23.75,31.23 23.23,30.71 R25.1 ; 23.75,31.23 R26.2
$1N1509: length 7.8
  Bottom Layer w0.152: M41.1 30.93,10.71 ; 30.93,10.71 31.29,10.35 ; 30.93,10.71 M42.1 ; 31.29,10.35 30.85,9.92 R41.1 ; 31.29,10.35 R42.2
$1N1583: length 8.1
  Bottom Layer w0.152: 16.21,10.44 15.88,10.77 15.49,10.77 ; 16.21,10.44 15.74,9.97 R39.1 ; 16.21,10.44 R40.2 ; M39.1 M40.1
$1N1657: length 8
  Bottom Layer w0.152: M33.1 7.05,17.82 ; 7.05,17.82 M34.1 ; 7.05,17.82 7.44,17.43 ; 7.44,17.43 7.1,17.09 R33.1 ; 7.44,17.43 R34.2
$1N1731: length 8
  Bottom Layer w0.152: 7.38,31.46 6.85,30.93 R23.1 ; 7.38,31.46 R24.2 ; 7.38,31.46 6.93,31.92 ; M23.1 6.93,31.92 ; 6.93,31.92 M24.1
$1N4820: length 7.7
  Top Layer w0.152: 9.07,39.28 M2.1 ; 9.07,39.28 8.77,38.98 ; 9.07,39.28 M1.1 ; 8.77,38.98 9.28,38.46 R1.1 ; 8.77,38.98 R2.2
$1N4826: length 7.7
  Top Layer w0.152: 25.33,39.03 M4.1 ; 25.33,39.03 M3.1 ; 25.33,39.03 24.88,38.58 ; 24.88,38.58 25.41,38.05 R3.1 ; 24.88,38.58 R4.2
$1N4832: length 7.5
  Top Layer w0.152: 41,39.21 42.58,39.21 M6.1 ; 41,39.21 40.55,38.75 ; 41,39.21 M5.1 ; R5.1 41.03,38.27 40.55,38.75 ; 40.55,38.75 R6.2
$1N4838: length 7.5
  Top Layer w0.152: 9,23.84 9.33,24.17 ; 9,23.84 9.53,23.3 R7.1 ; 9,23.84 R8.2 ; 9.33,24.17 M7.1 ; 9.33,24.17 M8.1
$1N4844: length 7.5
  Top Layer w0.152: 24.98,24.21 25.33,24.55 ; 24.98,24.21 R10.2 ; 24.98,24.21 25.41,23.78 R9.1 ; 25.33,24.55 M10.1 ; 25.33,24.55 M9.1
$1N4850: length 7.5
  Top Layer w0.152: 40.46,24.32 41.03,23.75 R11.1 ; 40.46,24.32 R12.2 ; 40.46,24.32 40.82,24.68 ; 40.82,24.68 M12.1 ; 40.82,24.68 M11.1
$1N4856: length 7.7
  Top Layer w0.152: M13.1 9.58,11.09 ; 9.58,11.09 M14.1 ; 9.58,11.09 9.17,10.68 ; 9.17,10.68 9.66,10.2 R13.1 ; 9.17,10.68 R14.2
$1N4862: length 7.6
  Top Layer w0.152: M15.1 24.44,11.09 24.55,10.98 25.35,10.98 ; R16.2 25.01,10.64 ; 25.01,10.64 25.35,10.98 ; 25.01,10.64 25.66,9.99 R15.1 ; M16.1 27.29,11.09 26.39,11.09 26.28,10.98 25.35,10.98
$1N4868: length 7.7
  Top Layer w0.152: R17.1 41.03,9.99 40.5,10.52 ; R18.2 40.5,10.52 ; 40.5,10.52 40.95,10.96 ; M17.1 40.95,10.96 ; 40.95,10.96 M18.1
$1N10938: length 7.7
  Bottom Layer w0.152: 39.19,32.04 M28.1 ; 39.19,32.04 39.6,31.63 ; 39.19,32.04 M27.1 ; 39.6,31.63 39.11,31.14 R27.1 ; 39.6,31.63 R28.2
$1N10996: length 7.9
  Bottom Layer w0.152: R20.2 16.09,38.12 ; 16.09,38.12 15.69,38.52 ; 16.09,38.12 15.61,37.64 R19.1 ; 15.69,38.52 M19.1 ; 15.69,38.52 M20.1
$1N11052: length 8
  Bottom Layer w0.152: 31.55,38.79 31.06,39.28 ; 31.55,38.79 R22.2 ; 31.55,38.79 31.11,38.35 R21.1 ; 31.06,39.28 M21.1 ; 31.06,39.28 M22.1
$1N11108: length 7.8
  Bottom Layer w0.152: R30.2 16.15,23.84 ; 16.15,23.84 15.82,24.17 ; 16.15,23.84 15.74,23.43 R29.1 ; 15.82,24.17 M30.1 ; 15.82,24.17 M29.1
$1N11164: length 7.8
  Bottom Layer w0.152: M31.1 31.18,24.55 ; 31.18,24.55 31.57,24.16 ; 31.18,24.55 M32.1 ; R31.1 31.11,23.69 31.57,24.16 ; 31.57,24.16 R32.2
$1N11220: length 7.8
  Bottom Layer w0.152: R36.2 23.78,17.22 ; 23.78,17.22 23.36,16.81 R35.1 ; 23.78,17.22 23.44,17.57 ; M35.1 23.44,17.57 ; 23.44,17.57 M36.1
$1N11276: length 8
  Bottom Layer w0.152: R38.2 39.35,17.53 ; 39.35,17.53 38.93,17.95 ; 39.35,17.53 38.98,17.16 R37.1 ; 38.93,17.95 M38.1 ; 38.93,17.95 M37.1
$1N19303: length 7.8
  Bottom Layer w0.152: R43.1 46.85,38.09 47.3,38.54 ; 47.3,38.54 46.93,38.9 ; 47.3,38.54 R44.2 ; 46.93,38.9 M43.1 ; 46.93,38.9 M44.1
$1N19419: length 8
  Bottom Layer w0.152: 47.47,25.16 47.11,24.79 R45.1 ; 47.47,25.16 R46.2 ; 47.47,25.16 47.06,25.57 ; M45.1 47.06,25.57 ; 47.06,25.57 M46.1
$1N32987: length 17.7
  Top Layer w0.152: SR1.9 52.58,34.65 53.98,36.04 62.86,36.04 62.93,36.11 62.93,37.63 v1(63.63,38.33)
  Bottom Layer w0.152: SR2.14 v1(63.63,38.33)
$1N32993: length 29.6
  Bottom Layer w0.152: SR3.14 63.63,21.18 58.67,26.14 56.26,26.14 50.42,31.98 50.42,34.39 50.48,34.46 52.01,34.46 53.34,35.79 57.14,35.79 SR2.9
$1N34192: length 20.1
  Top Layer w0.152: SR1.14 58.93,34.14 59.31,34.52 62.74,34.52 63.25,35.03 63.25,37.19 64.16,38.11 64.16,38.55 63.37,39.34 63.37,45.95 SR INPUT.2
$1N34221: length 61.3
  Top Layer w0.152: CHAIN OUTPUT.2 8.51,3.66 8.51,5.94 8.89,6.32 45.72,6.32 46.61,7.21 v1(46.61,12.04)
  Bottom Layer w0.152: v1(46.61,12.04) 53.73,19.16 SR3.9

## Copper pours and planes (outline as drawn; the poured copper is in the pictures)
GND on Top Layer: 0.15,49.86 74.86,49.86 74.86,0.15 0.15,0.15
GND on Bottom Layer: 0.15,49.86 74.86,49.86 74.86,0.15 0.15,0.15
GND on Inner1: 0.15,49.86 74.86,49.86 74.86,0.15 0.15,0.15
GND on Inner2: 0.15,49.86 74.86,49.86 74.86,0.15 0.15,0.15

## Text on the board
Top Silkscreen Layer: Patent Pending | Logic Voltage: 5V | Analog Range: 0-3.3V | Control: Serial Chain (SN74HC595) | Revision: Rev 1.0 - Dec 2025 | Designed by Prayag C. | PCB Stack: 4 layers (Comp-sign-GND-Comp) | Nodes: N1-N9 (Input), B1-B9 (Output) | SSRC v1.0 - Solid State Reconfigurable Circuit
